# EAGLE schematic 555 Oscillator Practice Board (EAGLE 9.4.2)
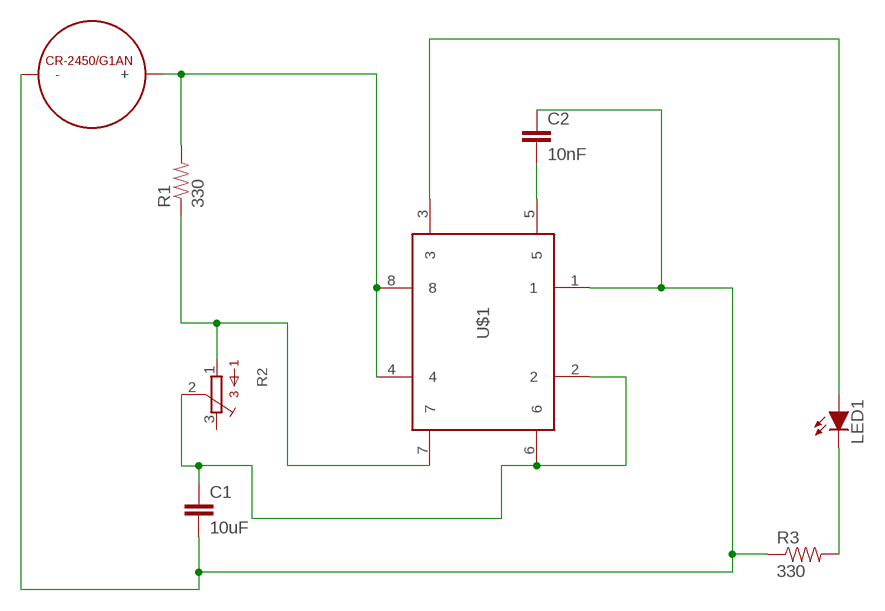
[diagram p0: schematic, sheet 1]

## Parts
C1  10uF  CAP_  [AXIAL-5MM]
C2  10nF  CAP_  [AXIAL-5MM]
LED1  LED-5MM  [LED-5MM]
R1  330  RESISTORAXIAL-0.3  [AXIAL-0.3]
R2  TRIMPOT_3296C  [TRIMPOT_3296]
R3  330  RESISTORAXIAL-0.3  [AXIAL-0.3]
U$1  555_TIMER  [DIL08]
U$2  CR-2450/G1AN  [CR-2450/G1AN]

## Nets
N$2: C1.P$2 C2.P$1 R3.P$1 U$1.1 U$2.-
N$3: R1.P$1 R2.1 U$1.7
N$8: R1.P$2 U$1.4 U$1.8 U$2.+_0(+) U$2.+_1(+)
N$9: LED1.A U$1.3
N$10: LED1.K(C) R3.P$2
N$11: C2.P$2 U$1.5
N$13: C1.P$1 R2.2 U$1.2 U$1.6
Unconnected: R2.3

## Library data of the parts
C1 C2 = HyTechDevices:CAP: Capacitor Standard 0603 ceramic capacitor, and 0.1" leaded capacitor.
LED1 = HyTechDevices:LED: Light Emitting Diode (LED) Source: Dangerous Prototypes Eagle Library <https://github.com/DangerousPrototypes/Eagle_Part_Library>
R1 R3 = HyTechDevices:RESISTOR: Resistor Basic schematic elements and footprints for 0603, 1206, and PTH resistors.
R2 = HyTechDevices:TRIMPOT_3296: 3296 Series 3/8" Square Trimmer Source <https://github.com/chiengineer/Eagle-Libraries/blob/master/Potentiometers/bourns.lbr>
U$1 = HyTechDevices:555_TIMER: Standard 555 Timer Fairchild Semiconductor LM555CN Texas Instruments LM555CN/NOPB
U$2 = HyTechDevices:CR-2450/G1AN: Panasonic CR2450 Battery through hole.